# Altium schematic sheet TensoStudent.SchDoc
size 420 x 297 mm; DocumentNumber: Тензодатчик; SheetNumber: 2; Format: A3
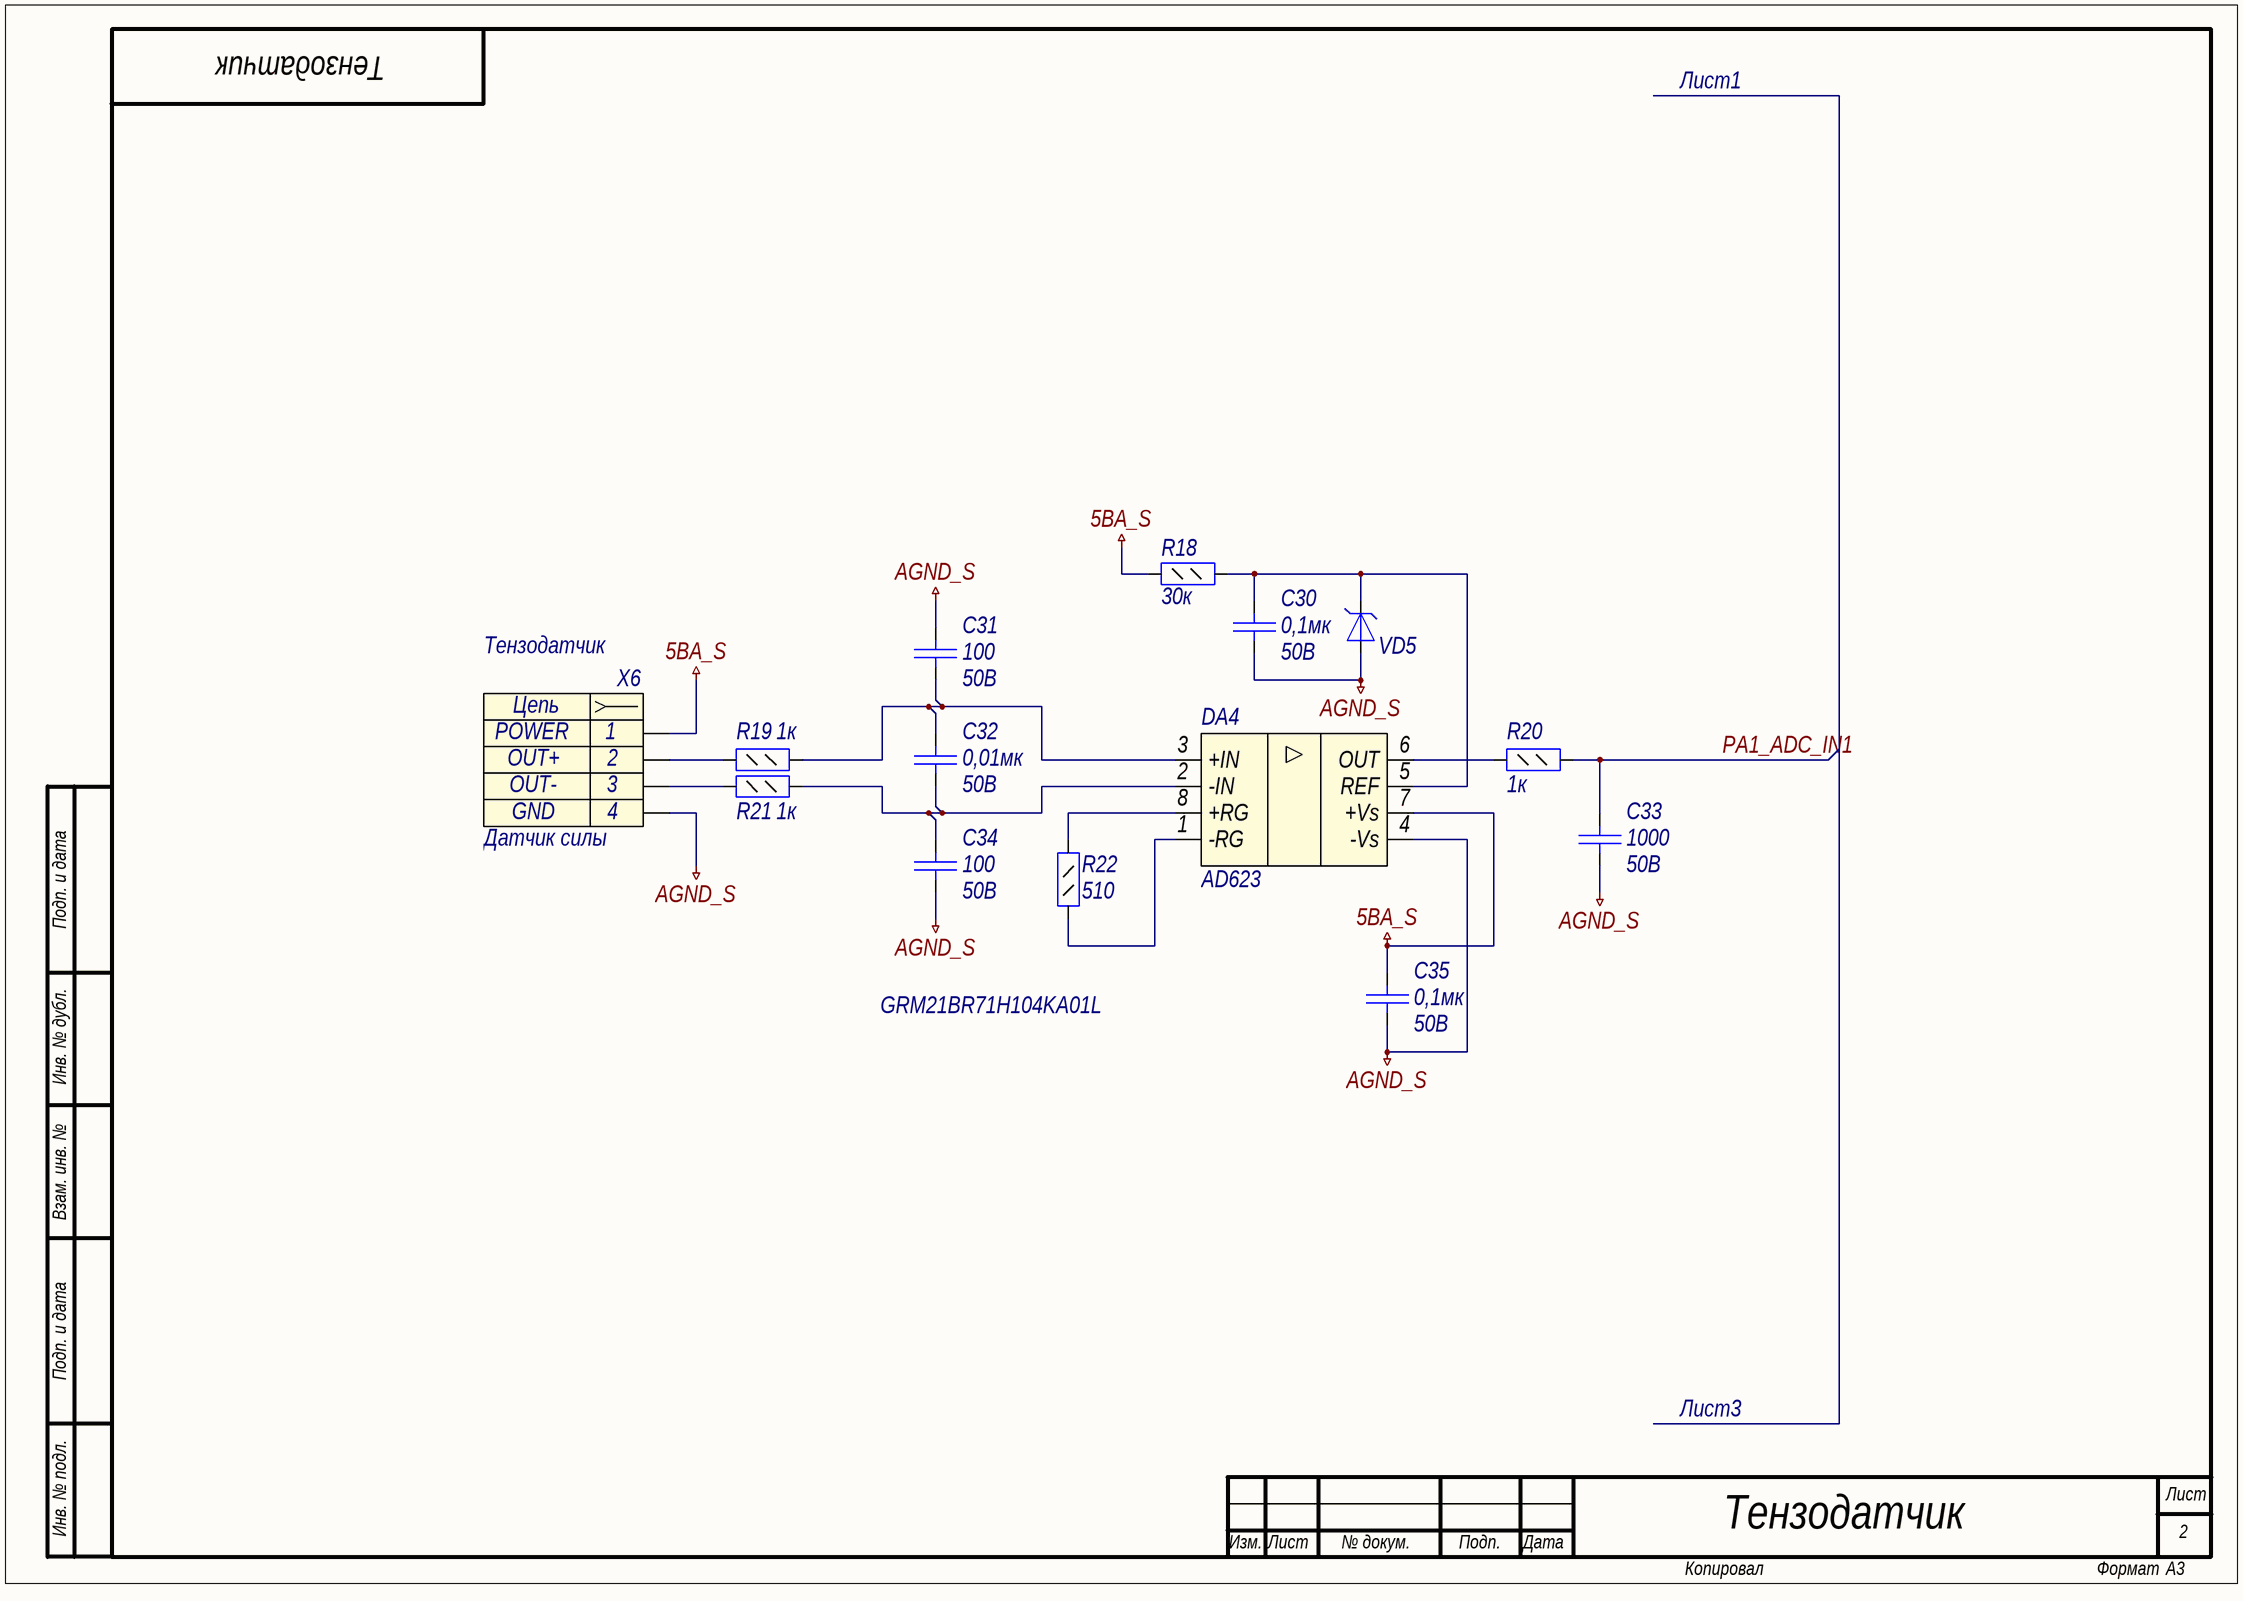
[diagram p0: TensoStudent.SchDoc]

## Parts
C30  value 0,1мк  Voltage: 50В  [C0805]  (hidden comment: Capacitor)
C31  value 100  Voltage: 50B  [C0603]  (hidden comment: Capacitor)
C32  value 0,01мк  Voltage: 50B  [C0805]  (hidden comment: Capacitor)
C33  value 1000  Voltage: 50B  [C0603]  (hidden comment: Capacitor)
C34  value 100  Voltage: 50B  [C0603]  (hidden comment: Capacitor)
C35  value 0,1мк  Voltage: 50В  [C0805]  (hidden comment: Capacitor)
DA4  AD623  [SO8]
R18  value 30к  [R0805]  (hidden comment: Resistor_0,125Вт)
R19  value 1к  [R0805]  (hidden comment: Resistor_0,125Вт)
R20  value 1к  [R0805]  (hidden comment: Resistor_0,125Вт)
R21  value 1к  [R0805]  (hidden comment: Resistor_0,125Вт)
R22  value 510  [R0805]  (hidden comment: Resistor_0,125Вт)
VD5  LM4040BIM3-2.5/NOPB  [SOT23-3]  (value not drawn)
X6  Датчик силы  [CWF-4R]

## Nets
5BA_S: C35.2 DA4.7(+Vs) R18.1 X6.1
AGND_S: C30.1 C31.2 C33.1 C34.1 C35.1 DA4.4(-Vs) VD5.2(A) X6.4
PA1_ADC_IN1: C33.2 R20.2
NetC30_2: C30.2 DA4.5(REF) R18.2 VD5.1(K)
NetC31_1: C31.1 C32.2 DA4.3(+IN) R19.2
NetC32_1: C32.1 C34.2 DA4.2(-IN) R21.2
NetDA4_1: DA4.1(-RG) R22.1
NetDA4_6: DA4.6(OUT) R20.1
NetDA4_8: DA4.8(+RG) R22.2
NetR19_1: R19.1 X6.2
NetR21_1: R21.1 X6.3

## Notes on the sheet
- Лист1
- Тензодатчик
- Подп. и дата
- Инв. № дубл.
- GRM21BR71H104KA01L
- Взам. инв. №
- Лист3
- Инв. № подл.
- Лист
- Изм.
- № докум.
- Подп.
- Дата
- Копировал
- Формат
- (in symbol DS1069-4MRW6SA) Цепь

## Library data of the parts
C30 C35 = cap160: Конденсатор; Part Name: Ceramic; Manufacture: Murata; Part Number: GRM21BR71H104KA01L; id: cap160; TKE: X7R
C31 C34 = cap91: Конденсатор; Part Name: Ceramic; Manufacture: Murata; Part Number: GRM1885C1H101J; id: cap91; TKE: NP0
C32 = cap136: Конденсатор; Part Name: Ceramic; Manufacture: Murata; Part Number: GRM216R71H103K; id: cap136; TKE: X7R
C33 = cap113: Конденсатор; Part Name: Ceramic; Manufacture: Murata; Part Number: GRM188R71H102K; id: cap113; TKE: X7R
DA4 = amp12: Low Cost Low Power  Instrumentation Amplifier; Part Number: AD623ARZ; Manufacture: Analog Devices; id: amp12; Rail-to-rail: yes; Supply Voltage: (+-)2,5-(+-)6B or 2,7-12B; Supply Current max: 550uA; Bandwidth: 800kHz; Input Bias Current: 17nA; CMRR: 110dB; PSRR: 130dB; Offset voltage: 25uB; Channels: 1; Part Name: Instrumentation Amplifier
R18 = res108: Резистор; Manufacture: Yageo; Part Number: RC0805FR-0730KL; id: res108; Accuracy: 0.01; Part Name: Resistor; Power: 0,125Вт
R19-R21 = res73: Резистор; Manufacture: Yageo; Part Number: RC0805FR-071KL; id: res73; Accuracy: 0.01; Part Name: Resistor; Power: 0,125Вт
R22 = res66: Резистор; Manufacture: Yageo; Part Number: RC0805FR-07510RL; id: res66; Accuracy: 0,01; Part Name: Resistor; Power: 0,125Вт
VD5 = LM4040BIM3-2.5/NOPB: Прецезионный источник опорного напряжения; Part Name: Precision Micropower Shunt Voltage Reference; id: ref0; Voltage min stabilize: 2,5B; Accuracy: 0.002; Output current: 15mA; Part Number: LM4040BIM3-2.5/NOPB
X6 = DS1069-4MRW6SA: Разъем - 4 конт. розетка; Contact_1: POWER; Contact_2: OUT+; Contact_3: OUT-; Contact_4: GND; Part Number: DS1069-4MRW6SA; Part Name: CWF-4R; Contact_5: Contact_5